# Altium schematic sheet CV060_AO.SchDoc
size A4
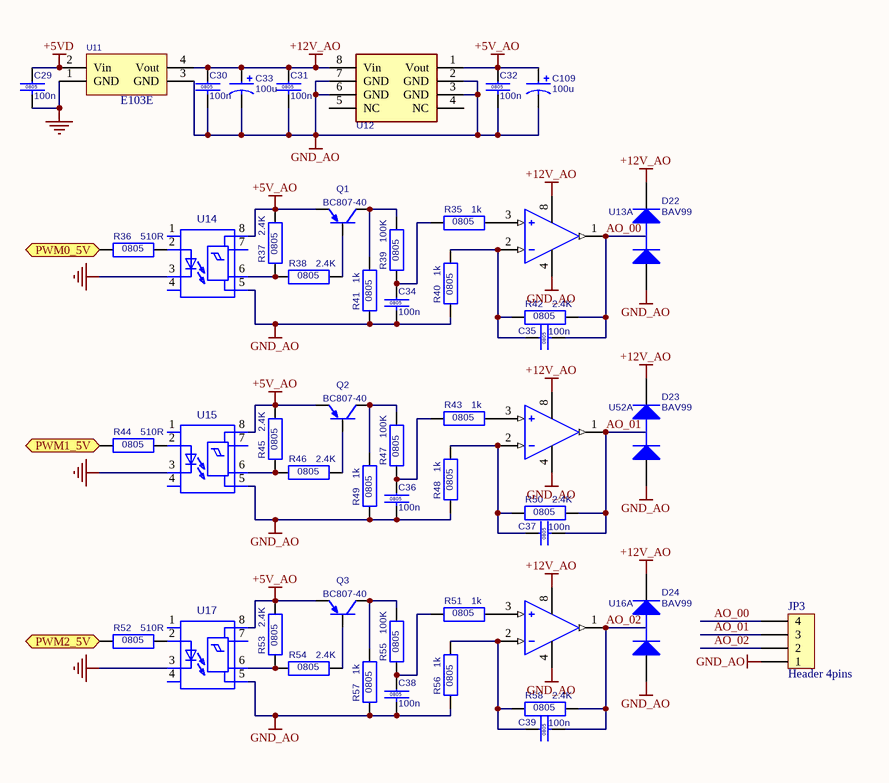
[diagram p0: CV060_AO.SchDoc]

## Parts
C29  Case: 0805  [RC0805]  (hidden comment: 100n)
C30  Case: 0805  [RC0805]  (hidden comment: 100n)
C31  Case: 0805  [RC0805]  (hidden comment: 100n)
C32  Case: 0805  [RC0805]  (hidden comment: 100n)
C33  100u  [CEH12.5D5P2.5]
C34  Case: 0805  [RC0805]  (hidden comment: 100n)
C35  Case: 0805  [RC0805]  (hidden comment: 100n)
C36  Case: 0805  [RC0805]  (hidden comment: 100n)
C37  Case: 0805  [RC0805]  (hidden comment: 100n)
C38  Case: 0805  [RC0805]  (hidden comment: 100n)
C39  Case: 0805  [RC0805]  (hidden comment: 100n)
C109  100u  [CEH12.5D5P2.5]
D22  BAV99  [SOT23-3]
D23  BAV99  [SOT23-3]
D24  BAV99  [SOT23-3]
JP3  Header 4pins  [PHOENIX_5.08_4PINS]
Q1  Part number: BC807-40  [SOT23-3]  (hidden comment: PNP_transistor_SOT23-3)
Q2  Part number: BC807-40  [SOT23-3]  (hidden comment: PNP_transistor_SOT23-3)
Q3  Part number: BC807-40  [SOT23-3]  (hidden comment: PNP_transistor_SOT23-3)
R35  Case: 0805  [RC0805]  (hidden comment: 1k)
R36  Case: 0805  [RC0805]  (hidden comment: 510R)
R37  Case: 0805  [RC0805]  (hidden comment: 2.4K)
R38  Case: 0805  [RC0805]  (hidden comment: 2.4K)
R39  Case: 0805  [RC0805]  (hidden comment: 100K)
R40  Case: 0805  [RC0805]  (hidden comment: 1k)
R41  Case: 0805  [RC0805]  (hidden comment: 1k)
R42  Case: 0805  [RC0805]  (hidden comment: 2.4K)
R43  Case: 0805  [RC0805]  (hidden comment: 1k)
R44  Case: 0805  [RC0805]  (hidden comment: 510R)
R45  Case: 0805  [RC0805]  (hidden comment: 2.4K)
R46  Case: 0805  [RC0805]  (hidden comment: 2.4K)
R47  Case: 0805  [RC0805]  (hidden comment: 100K)
R48  Case: 0805  [RC0805]  (hidden comment: 1k)
R49  Case: 0805  [RC0805]  (hidden comment: 1k)
R50  Case: 0805  [RC0805]  (hidden comment: 2.4K)
R51  Case: 0805  [RC0805]  (hidden comment: 1k)
R52  Case: 0805  [RC0805]  (hidden comment: 510R)
R53  Case: 0805  [RC0805]  (hidden comment: 2.4K)
R54  Case: 0805  [RC0805]  (hidden comment: 2.4K)
R55  Case: 0805  [RC0805]  (hidden comment: 100K)
R56  Case: 0805  [RC0805]  (hidden comment: 1k)
R57  Case: 0805  [RC0805]  (hidden comment: 1k)
R58  Case: 0805  [RC0805]  (hidden comment: 2.4K)
U11  Manufacturer Part Number: E103E  [SIP4]
U12  L78L05CD  [SO-8]  (value not drawn)
U13  LM2904D  [SO-8]  (value not drawn)  (part A of 2)
U14  6N137  [DIP8]  (value not drawn)
U15  6N137  [DIP8]  (value not drawn)
U16  LM2904D  [SO-8]  (value not drawn)  (part A of 2)
U17  6N137  [DIP8]  (value not drawn)
U52  LM2904D  [SO-8]  (value not drawn)  (part A of 2)

## Ports
PWM0_5V (in), PWM1_5V (in), PWM2_5V (in)

## Nets
+5V_AO: C32.1 C109.1 Q1.2(E) Q2.2(E) Q3.2(E) R37.2 R45.2 R53.2 U12.1(Vout) U14.8 U15.8 U17.8
+5VD: C29.1 U11.2(Vin)
+12V_AO: C30.1 C31.1 C33.1 D22.2(K) D23.2(K) D24.2(K) U11.4(Vout) U12.8(Vin) U13.8(Vcc+) U16.8(Vcc+) U52.8(Vcc+)
DGND: C29.2 U11.1(GND) U14.3 U15.3 U17.3
GND_AO: C30.2 C31.2 C32.2 C33.2 C34.2 C36.2 C38.2 C109.2 D22.1(A) D23.1(A) D24.1(A) JP3.1 R40.1 R41.1 R48.1 R49.1 R56.1 R57.1 U11.3(GND) U12.2(GND) U12.3(GND) U12.6(GND) U12.7(GND) U13.4(Vcc-) U14.5 U15.5 U16.4(Vcc-) U17.5 U52.4(Vcc-)
AO_00: C35.2 D22.3(C) JP3.4 R42.2 U13.1(OUT1)
AO_01: C37.2 D23.3(C) JP3.3 R50.2 U52.1(OUT1)
AO_02: C39.2 D24.3(C) JP3.2 R58.2 U16.1(OUT1)
PWM0_5V: R36.1 ; port PWM0_5V
PWM1_5V: R44.1 ; port PWM1_5V
PWM2_5V: R52.1 ; port PWM2_5V
NetC34_1: C34.1 R35.1 R39.1
NetC35_1: C35.1 R40.2 R42.1 U13.2(IN1-)
NetC36_1: C36.1 R43.1 R47.1
NetC37_1: C37.1 R48.2 R50.1 U52.2(IN1-)
NetC38_1: C38.1 R51.1 R55.1
NetC39_1: C39.1 R56.2 R58.1 U16.2(IN1-)
NetQ1_1: Q1.1(B) R38.2
NetQ1_3: Q1.3(C) R39.2 R41.2
NetQ2_1: Q2.1(B) R46.2
NetQ2_3: Q2.3(C) R47.2 R49.2
NetQ3_1: Q3.1(B) R54.2
NetQ3_3: Q3.3(C) R55.2 R57.2
NetR35_2: R35.2 U13.3(IN1+)
NetR36_2: R36.2 U14.2
NetR37_1: R37.1 R38.1 U14.6
NetR43_2: R43.2 U52.3(IN1+)
NetR44_2: R44.2 U15.2
NetR45_1: R45.1 R46.1 U15.6
NetR51_2: R51.2 U16.3(IN1+)
NetR52_2: R52.2 U17.2
NetR53_1: R53.1 R54.1 U17.6

Not connected (* = marked no-connect by the designer): U12 4(NC) 5(NC); U14 1 4 7; U15 1 4 7; U17 1 4 7

## Library data of the parts
C29-C32 C34-C39 = CC0805K-X5R-50V0-100N: Chip capacitor, 20p; Manufacturer: KEMET, YAGEO; Voltage: 50V; Tolerance: 10%; ROSH: Yes; Material: X5R; Package: 7" paper reel; Part number: CC0805K-X5R-50V0-100N; Suppliers: Avnet; Temperature: -55 - +125 C; Value: 100n; Supplier: Avnet-Abacus; Pb Free: Yes; Component Type: Standard; ComponentLink1Description: Manufacturer Link; ComponentLink2Description: Datasheet; ComponentLink2URL: http://www.yageo.com/pdf/UPY-GPHC_X5R_6.3V-to-50V_3.pdf; Published: 05.04.2010; Publisher: ppavlov
C33 C109 = CEH12.5D5P2.5M-16V-100U: Electrolytic capacitor; Manufacturer: Panasonic; Manufacturer Part Number: C H12.5D5P2.5M-16V-100U; Voltage: 16V; Tolerance: 20%; Pb Free: Yes; Case: 12.5x5x2.5; Value: 100u; Part Number: CEH12.5D5P2.5M-16V-100U; Temperature: -55 - +105 C; Supplier: Megasan; MOQ: 500; Component Type: Standard; ComponentLink1Description: Manufacturer Link; ComponentLink2Description: Datasheet; ComponentLink2URL: http://industrial.panasonic.com/www-data/pdf/ABA0000/ABA0000CE22.pdf; Published: 11.12.2009; Publisher: ppavlov
D22-D24 = BAV99: Dual small signal diode; Manufacturer: Fairchild; Forward current: 0.2A; Breakdown Voltage: 70V; Pb Free: Yes; Stock ID: D040; Temperature: -55 - +150 C; Supplier: EBV; Manufacturer Part Number: BAV99; Component Type: Standard; ComponentLink1Description: Manufacturer Link; Case: SOT23-3; ComponentLink2Description: Datasheet; ComponentLink2URL: http://www.fairchildsemi.com/ds/BA%2FBAV99.pdf; Published: 16.11.2009; Publisher: tkondratyuk; Part Number: BAV99; Current: 0.2A; Voltage: 70V
JP3 = 2EDGR-5.08-04P-14: 5.08mm angled 4pins receptabe; Manufacturer Part Number: 2EDGR-5.0-04P-14; Pins number: 4; Pb Free: Yes; Part Number: 2EDGR-5.08-04P-14; Temperature: -40 - +105 C; Supplier: Biakom; Component Type: Standard; ComponentLink1Description: Manufacturer Link; Case: PHOENIX_5.08_4PINS; ComponentLink2Description: Datasheet; Published: 17.08.2010; Publisher: ppavlov
Q1-Q3 = BC807-40: General Purpose  PNP Transistor; Manufacturer: ONS, NXP; Manufacturer Part Number: BC807?40LT1G; Analogs: MMBT2907A; Current: 0.5A; Voltage CEO: -45V; Pb Free: Yes; Stock ID: Q010; Temperature: -55 - +150 C; Supplier: EBV; MOQ: 3000; Package: Tape and Reel; Component Type: Standard; ComponentLink1Description: Manufacturer Link; Case: SOT23-3; ComponentLink2Description: Datasheet; ComponentLink2URL: http://www.onsemi.com/pub/Collateral/BC807-16LT1-D.PDF; Published: 16.11.2009; Publisher: tkondratyuk
R35 R40 R41 R43 R48 R49 R51 R56 R57 = RC0805F-1K00: Chip resistor; Manufacturer: PHILIPS, SAMSUNG; Voltage: 200V; Power: 1/10W; Tolerance: 1%; Pb Free: Yes; Value: 1k; Part Number: RC0805F-1K00; Temperature: -55 - +155 C; Supplier: Megasan; Component Type: Standard; ComponentLink1Description: Manufacturer Link; ComponentLink2Description: Datasheet; ComponentLink2URL: http://www.yageo.com/pdf/PYu-RC1206_51_RoHS_L_4.pdf; Published: 11.12.2009; Publisher: ppavlov
R36 R44 R52 = RC0805F-510R: Chip resistor; Manufacturer: PHILIPS, SAMSUNG; Voltage: 200V; Power: 1/10W; Tolerance: 1%; Pb Free: Yes; Value: 510R; Part Number: RC0805F-510R; Temperature: -55 - +155 C; Supplier: Megasan; Component Type: Standard; ComponentLink1Description: Manufacturer Link; ComponentLink2Description: Datasheet; ComponentLink2URL: http://www.yageo.com/pdf/PYu-RC1206_51_RoHS_L_4.pdf; Published: 11.12.2009; Publisher: ppavlov
R37 R38 R42 R45 R46 R50 R53 R54 R58 = RC0805F-2K40: Chip resistor; Manufacturer: PHILIPS, SAMSUNG; Voltage: 200V; Power: 1/10W; Tolerance: 1%; Pb Free: Yes; Value: 2.4K; Part Number: RC0805F-2K40; Temperature: -55 - +155 C; Supplier: Megasan; Component Type: Standard; ComponentLink1Description: Manufacturer Link; ComponentLink2Description: Datasheet; ComponentLink2URL: http://www.yageo.com/pdf/PYu-RC1206_51_RoHS_L_4.pdf; Published: 11.12.2009; Publisher: ppavlov
R39 R47 R55 = RC0805F-100K: Chip resistor; Manufacturer: PHILIPS, SAMSUNG; Voltage: 200V; Power: 1/10W; Tolerance: 1%; Pb Free: Yes; Value: 100K; Part Number: RC0805F-100K; Temperature: -55 - +155 C; Supplier: Megasan; Component Type: Standard; ComponentLink1Description: Manufacturer Link; ComponentLink2Description: Datasheet; ComponentLink2URL: http://www.yageo.com/pdf/PYu-RC1206_51_RoHS_L_4.pdf; Published: 11.12.2009; Publisher: ppavlov
U11 = 1-05-12S: 1W Insulated DCDC converter 5 to 12V; Manufacturer: TI; Pb Free: Yes; Part Number: 1-05-12S; Temperature: -40 - +85 C; Component Type: Standard; ComponentLink1Description: Manufacturer Link; Case: SIP4; ComponentLink2Description: Datasheet; Published: 07.01.2010; Publisher: ppavlov
U12 = L78L05CD: Regulator 100ma 5V; Manufacturer: ST; Pb Free: Yes; Part Number: L78L05CD; Temperature: -40 - +150 C; Manufacturer Part Number: L78L05CD; Component Type: Standard; ComponentLink1Description: Manufacturer Link; Case: SO-8; ComponentLink2Description: Datasheet; Published: 07.01.2010; Publisher: ppavlov
U13 U16 U52 = LM2904D: Dual opamps; Manufacturer: TI; Pb Free: Yes; Part Number: LM2904D; Temperature: -40 - +125 C; Supplier: EBV; Manufacturer Part Number: LM2904D; Component Type: Standard; ComponentLink1Description: Manufacturer Link; Case: SO-8; ComponentLink2Description: Datasheet; ComponentLink2URL: http://www.ti.com/lit/gpn/lm2904; Published: 13.11.2009; Publisher: tkondratyuk
U14 U15 U17 = 6N137: High CMR, High Speed TTL / Compatible Optocouplers; Value: *; Part Number: 6N137; Manufacturer Part Number: 6N137; Component Type: Standard; ComponentLink1Description: Manufacturer Link; Case: DIP8; ComponentLink2Description: Datasheet; Published: 06.04.2010; Publisher: ppavlov